# Altium schematic sheet LCDTFTAVDD_TPS61040.SchDoc
size A3
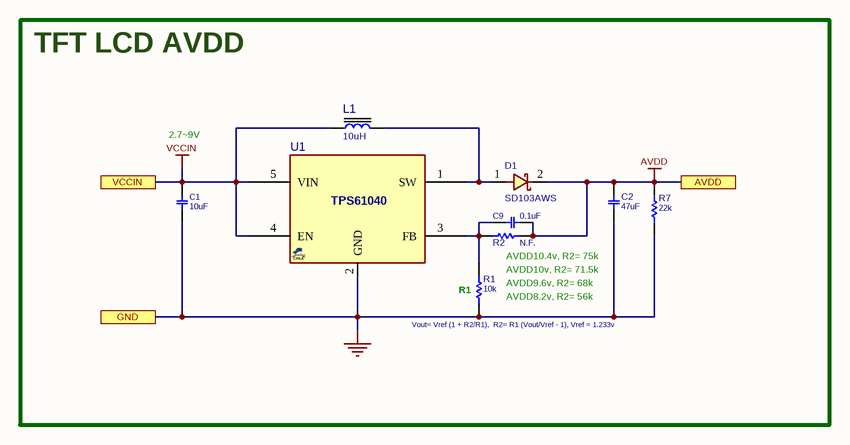
[diagram p0: LCDTFTAVDD_TPS61040.SchDoc]

## Parts
C1  10uF  [C0402]
C2  47uF  [C1206]
C9  0.1uF  [C0402]
D1  SD103AWS  [D_SOD323]
L1  10uH  [L_4]
R1  10k  [R0402]
R2  N.F.  [R0402]
R7  22k  [R0402]
U1  TPS61040  [SOT23_5]  (value not drawn)

## Ports
AVDD, GND, VCCIN

## Nets
AVDD: C2.2 C9.1 D1.2 R2.2 R7.1 ; port AVDD
GND: C1.1 C2.1 R1.2 R7.2 U1.2(GND) ; port GND
VCCIN: C1.2 L1.1 U1.4(EN) U1.5(VIN) ; port VCCIN
NetC9_2: C9.2 R1.1 R2.1 U1.3(FB)
NetD1_1: D1.1 L1.2 U1.1(SW)

## Notes on the sheet
- TFT LCD AVDD
- 2.7~9V
- (near R1) R1
- (near R2) AVDD10.4v, R2= 75k
- AVDD10v, R2= 71.5k
- AVDD9.6v, R2= 68k
- (near R1) AVDD8.2v, R2= 56k
- (near R1) Vout= Vref (1 + R2/R1),  R2= R1 (Vout/Vref - 1), Vref = 1.233v

## Library data of the parts
C1 = CAP_SMD_MLCC: CAP, MLCC; PARAM: X5R, 10%; MANF_P#: CL10A106MO8NQNC; MANF: Samsung; PARAM2: 16v; PRICE: 5000:	$0.01; ASSEMBLY: ASSEMBLY; VALUE: 10uF
C2 = CAP_SMD_MLCC: CAP, MLCC; PARAM: X5R, 10%; MANF_P#: GRM31CR61E476ME44L; MANF: Murata; PARAM2: 25v; PRICE: 100:	$0.27; ASSEMBLY: ASSEMBLY; VALUE: 47uF
C9 = CAP_SMD_MLCC_100n50V: CAP, MLCC, 100nF, 50V, X7R, 10%, 0402C; MANF: Murata; MANF_P#: GCM155R71H104KE02D; PARAM: 50V; DESC: CAP, MLCC, 100nF, 50V, X7R, 10%, 0402C; PARAM2: X7R, 10%; ASSEMBLY: ASSEMBLY; PRICE: 100= 1.3$; VALUE: 0.1uF
D1 = DIODE_SMD_SCHOTTKY_1N5819: DIODE, SCHOTTKY, 40V, 2A; MANF: DIODES; DESC: DESCRIPTION; MANF_P#: SD103AWS; ASSEMBLY: ASSEMBLY; PRICE: PRICE; PARAM2: 2A; PARAM: 40V; VALUE: SD103AWS
L1 = INDPWR_SMD: INDUCTOR, POWER, SMD; MANF_P#: GCD43-100MC; VALUE: 10uH
R1 R2 R7 = RES_SMD: RESISTOR, SMD, 20K, 0402; MANF: Yageo; PARAM: 0.063W; DIST#: MOUSER; PARAM2: 1%; MANF_P#: RK73H1ETTP2002F; ASSEMBLY: ASSEMBLY; PRICE: 100= 0.5$; DESC: RESISTOR, SMD, 20K, 0402
  R1: VALUE: 10k
  R2: VALUE: N.F.
  R7: VALUE: 22k
U1 = VREG_TPS61040_SOT23: REG, Switching, Boost, 0.4A, ADJ, 1MHz, SOT-23-5; PARAM2: 1MHz, 1.8~6VIN; MANF_P#: TPS61040DBVR; MANF: TI; PARAM: 0.4A, ADJ; VALUE: TPS61040